# EAGLE design rwr_schematic (EAGLE 7.4.0)

## Sheet 1 of 8: Microcontroller Circuitry
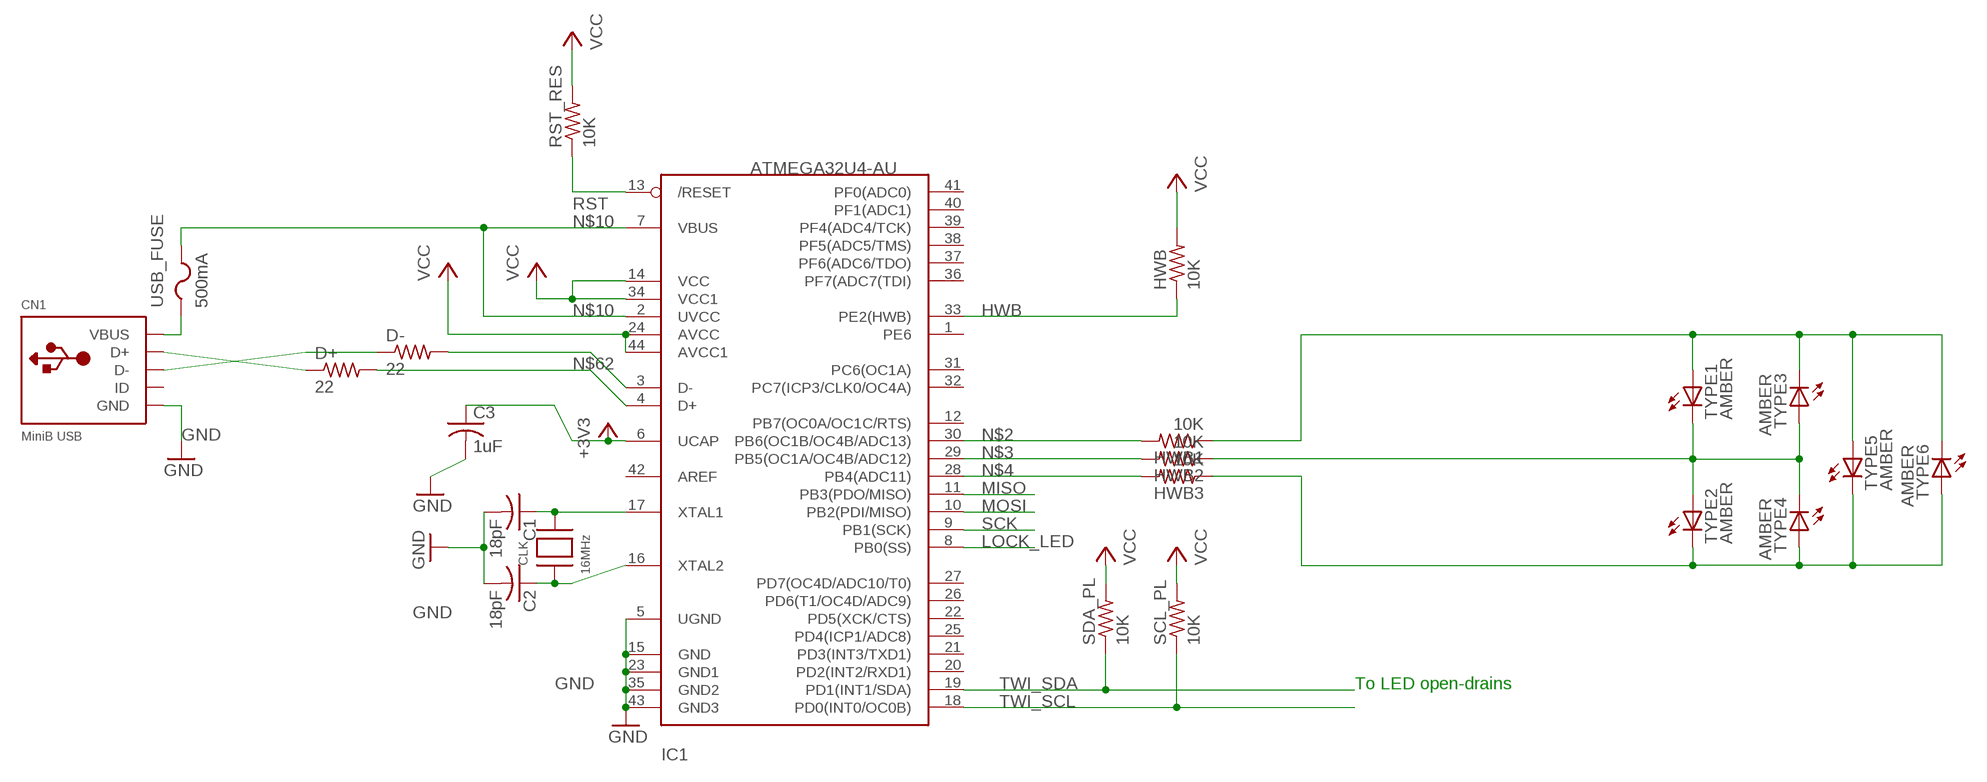
[diagram p0: schematic, sheet 1]

### Parts
C1  18pF  C-USC0805K  [C0805K]
C2  18pF  C-USC0805K  [C0805K]
C3  1uF  C-USC0805K  [C0805K]
CLK  16MHz  XTALNX5032  [NX5032]
CN1  MiniB USB  USBMINIB  [USB-MINIB]
D+  22  R-US_R0805  [R0805]
D-  22  R-US_R0805  [R0805]
HWB  10K  R-US_R0805  [R0805]
HWB1  10K  R-US_R0805  [R0805]
HWB2  10K  R-US_R0805  [R0805]
HWB3  10K  R-US_R0805  [R0805]
IC1  ATMEGA32U4-AU  [TQFP44]
RST_RES  10K  R-US_R0805  [R0805]
SCL_PL  10K  R-US_R0805  [R0805]
SDA_PL  10K  R-US_R0805  [R0805]
TYPE1  AMBER  LED3MM  [LED3MM]
TYPE2  AMBER  LED3MM  [LED3MM]
TYPE3  AMBER  LED3MM  [LED3MM]
TYPE4  AMBER  LED3MM  [LED3MM]
TYPE5  AMBER  LED3MM  [LED3MM]
TYPE6  AMBER  LED3MM  [LED3MM]
USB_FUSE  500mA  PTCFUSE-1206  [R1206]

### Nets
+3V3: C3.1 IC1.6(UCAP)
GND [Power]: C1.2 C2.2 C3.2 CN1.GND IC1.5(UGND) IC1.15(GND) IC1.23(GND1) IC1.35(GND2) IC1.43(GND3) ; also sheet 2,3,4,5,6,7,8
HWB: HWB.1 IC1.33(PE2(HWB))
LOCK_LED: IC1.8(PB0(SS)) ; also sheet 8
MISO: IC1.11(PB3(PDO/MISO)) ; also sheet 3
MOSI: IC1.10(PB2(PDI/MISO)) ; also sheet 3
N$2: HWB1.2 IC1.30(PB6(OC1B/OC4B/ADC13))
N$3: HWB2.2 IC1.29(PB5(OC1A/OC4B/ADC12))
N$4: HWB3.2 IC1.28(PB4(ADC11))
N$10: IC1.2(UVCC) IC1.7(VBUS) USB_FUSE.2
N$61: D-.2 IC1.3(D-)
N$62: D+.2 IC1.4(D+)
N$63: C2.1 CLK.P$1 IC1.16(XTAL2)
N$64: C1.1 CLK.P$2 IC1.17(XTAL1)
N$67: CN1.D+ D+.1
N$68: CN1.D- D-.1
RST: IC1.13(/RESET) RST_RES.1 ; also sheet 3
SCK: IC1.9(PB1(SCK)) ; also sheet 3
TWI_SCL: IC1.18(PD0(INT0/OC0B)) SCL_PL.1 ; also sheet 4,5,6,7
TWI_SDA: IC1.19(PD1(INT1/SDA)) SDA_PL.1 ; also sheet 4,5,6,7
TYPE_LED0: HWB3.1 TYPE2.K(C) TYPE4.A TYPE5.K(C) TYPE6.A
TYPE_LED1: HWB2.1 TYPE1.K(C) TYPE2.A TYPE3.A TYPE4.K(C)
TYPE_LED2: HWB1.1 TYPE1.A TYPE3.K(C) TYPE5.A TYPE6.K(C)
VBUS: CN1.VBUS USB_FUSE.1
VCC [Power]: HWB.2 IC1.14(VCC) IC1.24(AVCC) IC1.34(VCC1) IC1.44(AVCC1) RST_RES.2 SCL_PL.2 SDA_PL.2 ; also sheet 2,3,4,5,6,7,8
Unconnected: CN1.ID IC1.1(PE6) IC1.12(PB7(OC0A/OC1C/RTS)) IC1.20(PD2(INT2/RXD1)) IC1.21(PD3(INT3/TXD1)) IC1.22(PD5(XCK/CTS)) IC1.25(PD4(ICP1/ADC8)) IC1.26(PD6(T1/OC4D/ADC9)) IC1.27(PD7(OC4D/ADC10/T0)) IC1.31(PC6(OC1A)) IC1.32(PC7(ICP3/CLK0/OC4A)) IC1.36(PF7(ADC7(TDI)) IC1.37(PF6(ADC6/TDO)) IC1.38(PF5(ADC5/TMS)) IC1.39(PF4(ADC4/TCK)) IC1.40(PF1(ADC1)) IC1.41(PF0(ADC0)) IC1.42(AREF)

### Notes on the sheet
- To LED open-drains

## Sheet 2 of 8: Power Circuitry
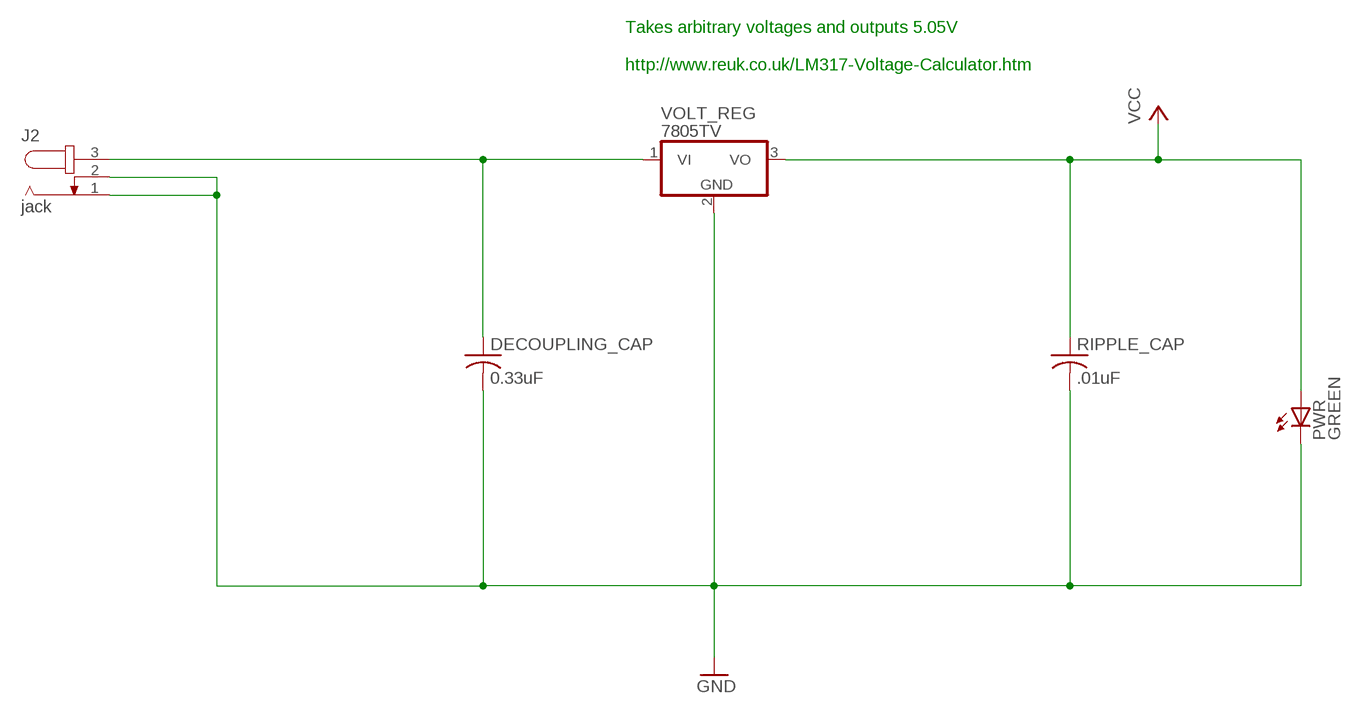
[diagram p1: schematic, sheet 2]

### Parts
DECOUPLING_CAP  0.33uF  C-USC0805K  [C0805K]
J2  jack  JACK-PLUG0  [SPC4077]
PWR  GREEN  LEDCHIPLED_0805  [CHIPLED_0805]
RIPPLE_CAP  .01uF  C-USC0805K  [C0805K]
VOLT_REG  7805TV  [TO220V]

### Nets
GND [Power]: DECOUPLING_CAP.2 J2.1 J2.2 PWR.C RIPPLE_CAP.2 VOLT_REG.2(GND) ; also sheet 1,3,4,5,6,7,8
JACK_VCC [Power]: DECOUPLING_CAP.1 J2.3 VOLT_REG.1(VI)
VCC [Power]: PWR.A RIPPLE_CAP.1 VOLT_REG.3(VO) ; also sheet 1,3,4,5,6,7,8

### Notes on the sheet
- Takes arbitrary voltages and outputs 5.05V
  
  http://www.reuk.co.uk/LM317-Voltage-Calculator.htm

## Sheet 3 of 8: ISP Programmer
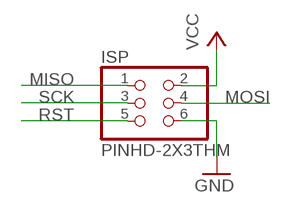
[diagram p2: schematic, sheet 3]

### Parts
ISP  PINHD-2X3THM  [ISP6]

### Nets
GND [Power]: ISP.6 ; also sheet 1,2,4,5,6,7,8
MISO: ISP.1 ; also sheet 1
MOSI: ISP.4 ; also sheet 1
RST: ISP.5 ; also sheet 1
SCK: ISP.3 ; also sheet 1
VCC [Power]: ISP.2 ; also sheet 1,2,4,5,6,7,8

## Sheet 4 of 8: Signal Strength LEDs
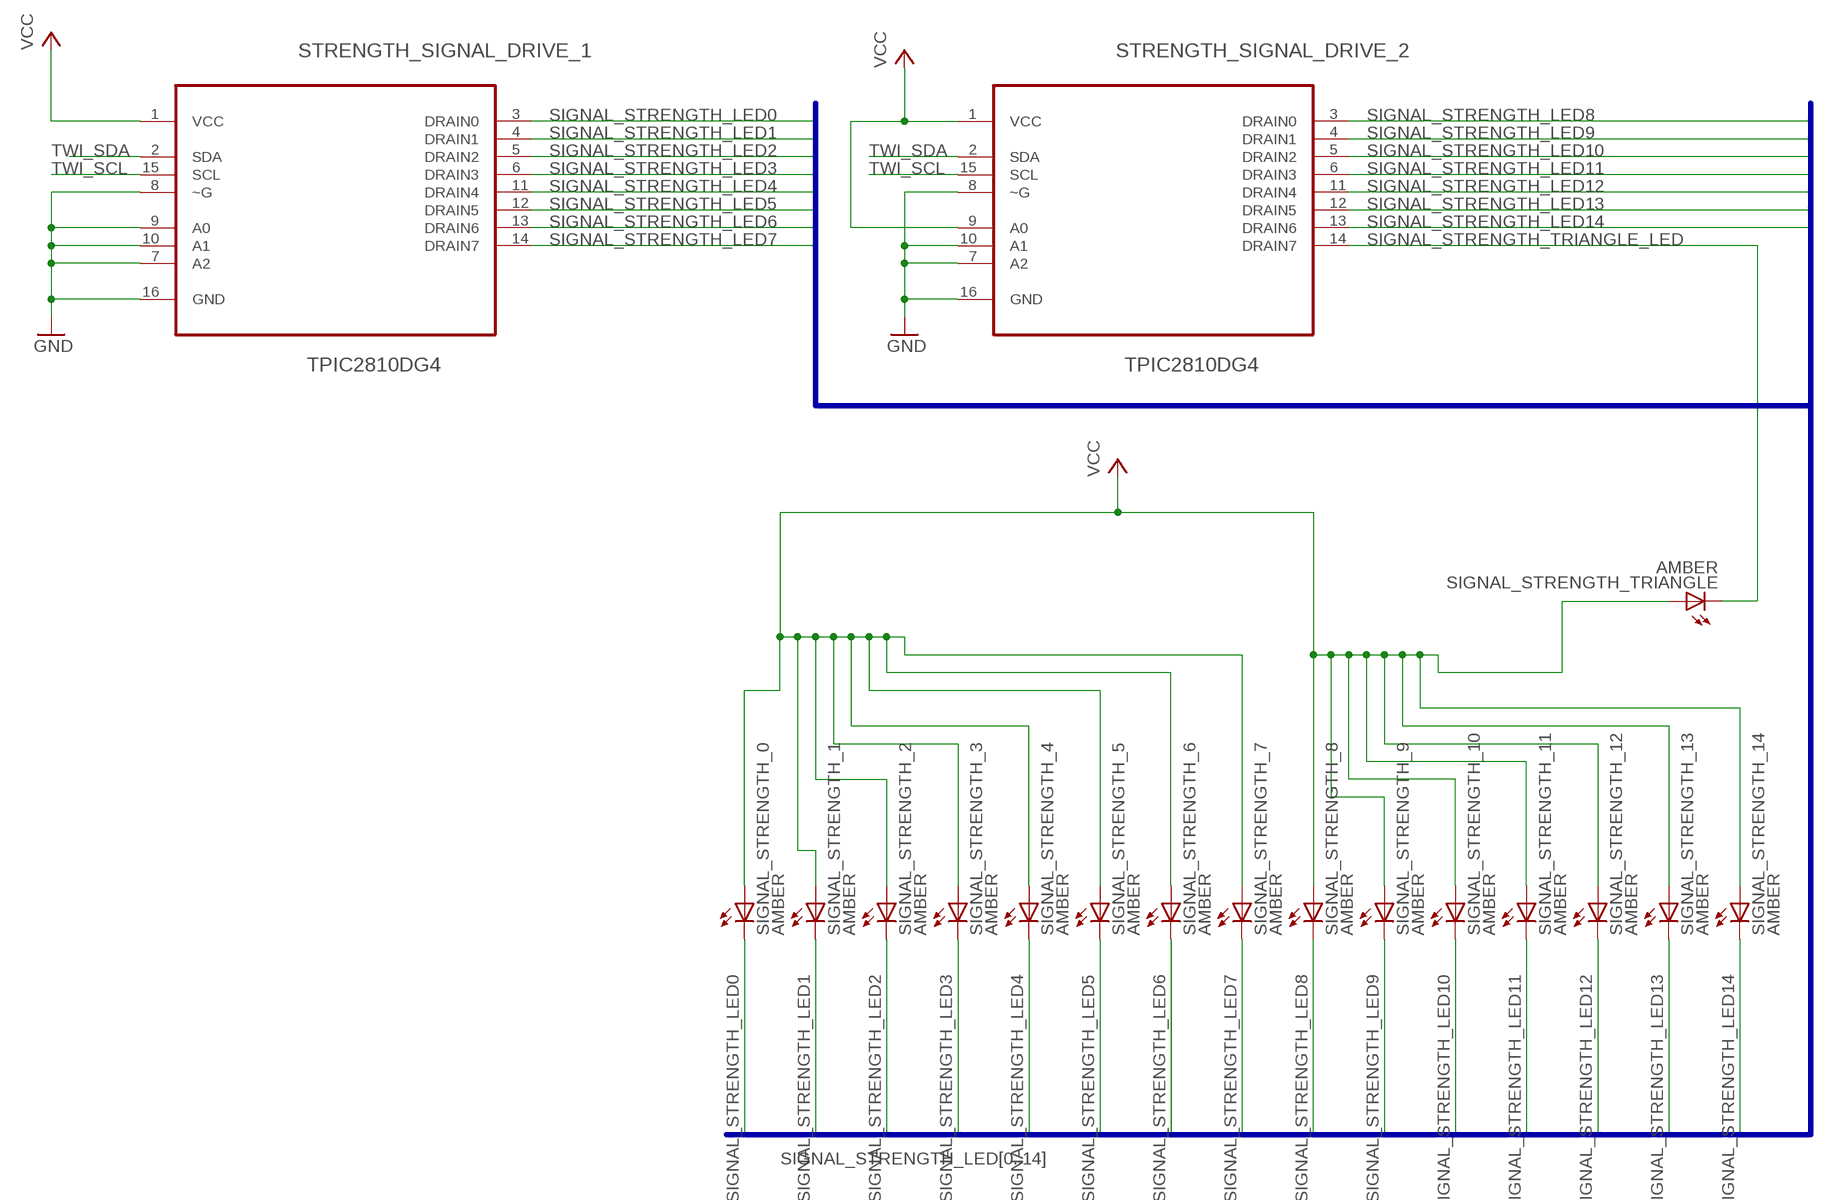
[diagram p3: schematic, sheet 4]

### Parts
SIGNAL_STRENGTH_0  AMBER  LED3MM  [LED3MM]
SIGNAL_STRENGTH_1  AMBER  LED3MM  [LED3MM]
SIGNAL_STRENGTH_2  AMBER  LED3MM  [LED3MM]
SIGNAL_STRENGTH_3  AMBER  LED3MM  [LED3MM]
SIGNAL_STRENGTH_4  AMBER  LED3MM  [LED3MM]
SIGNAL_STRENGTH_5  AMBER  LED3MM  [LED3MM]
SIGNAL_STRENGTH_6  AMBER  LED3MM  [LED3MM]
SIGNAL_STRENGTH_7  AMBER  LED3MM  [LED3MM]
SIGNAL_STRENGTH_8  AMBER  LED3MM  [LED3MM]
SIGNAL_STRENGTH_9  AMBER  LED3MM  [LED3MM]
SIGNAL_STRENGTH_10  AMBER  LED3MM  [LED3MM]
SIGNAL_STRENGTH_11  AMBER  LED3MM  [LED3MM]
SIGNAL_STRENGTH_12  AMBER  LED3MM  [LED3MM]
SIGNAL_STRENGTH_13  AMBER  LED3MM  [LED3MM]
SIGNAL_STRENGTH_14  AMBER  LED3MM  [LED3MM]
SIGNAL_STRENGTH_TRIANGLE  AMBER  LED3MM  [LED3MM]
STRENGTH_SIGNAL_DRIVE_1  TPIC2810DG4  [SOIC127P600X175-16N]
STRENGTH_SIGNAL_DRIVE_2  TPIC2810DG4  [SOIC127P600X175-16N]

### Nets
GND [Power]: STRENGTH_SIGNAL_DRIVE_1.7(A2) STRENGTH_SIGNAL_DRIVE_1.8(~G) STRENGTH_SIGNAL_DRIVE_1.9(A0) STRENGTH_SIGNAL_DRIVE_1.10(A1) STRENGTH_SIGNAL_DRIVE_1.16(GND) STRENGTH_SIGNAL_DRIVE_2.7(A2) STRENGTH_SIGNAL_DRIVE_2.8(~G) STRENGTH_SIGNAL_DRIVE_2.10(A1) STRENGTH_SIGNAL_DRIVE_2.16(GND) ; also sheet 1,2,3,5,6,7,8
SIGNAL_STRENGTH_LED0: SIGNAL_STRENGTH_0.K(C) STRENGTH_SIGNAL_DRIVE_1.3(DRAIN0)
SIGNAL_STRENGTH_LED1: SIGNAL_STRENGTH_1.K(C) STRENGTH_SIGNAL_DRIVE_1.4(DRAIN1)
SIGNAL_STRENGTH_LED2: SIGNAL_STRENGTH_2.K(C) STRENGTH_SIGNAL_DRIVE_1.5(DRAIN2)
SIGNAL_STRENGTH_LED3: SIGNAL_STRENGTH_3.K(C) STRENGTH_SIGNAL_DRIVE_1.6(DRAIN3)
SIGNAL_STRENGTH_LED4: SIGNAL_STRENGTH_4.K(C) STRENGTH_SIGNAL_DRIVE_1.11(DRAIN4)
SIGNAL_STRENGTH_LED5: SIGNAL_STRENGTH_5.K(C) STRENGTH_SIGNAL_DRIVE_1.12(DRAIN5)
SIGNAL_STRENGTH_LED6: SIGNAL_STRENGTH_6.K(C) STRENGTH_SIGNAL_DRIVE_1.13(DRAIN6)
SIGNAL_STRENGTH_LED7: SIGNAL_STRENGTH_7.K(C) STRENGTH_SIGNAL_DRIVE_1.14(DRAIN7)
SIGNAL_STRENGTH_LED8: SIGNAL_STRENGTH_8.K(C) STRENGTH_SIGNAL_DRIVE_2.3(DRAIN0)
SIGNAL_STRENGTH_LED9: SIGNAL_STRENGTH_9.K(C) STRENGTH_SIGNAL_DRIVE_2.4(DRAIN1)
SIGNAL_STRENGTH_LED10: SIGNAL_STRENGTH_10.K(C) STRENGTH_SIGNAL_DRIVE_2.5(DRAIN2)
SIGNAL_STRENGTH_LED11: SIGNAL_STRENGTH_11.K(C) STRENGTH_SIGNAL_DRIVE_2.6(DRAIN3)
SIGNAL_STRENGTH_LED12: SIGNAL_STRENGTH_12.K(C) STRENGTH_SIGNAL_DRIVE_2.11(DRAIN4)
SIGNAL_STRENGTH_LED13: SIGNAL_STRENGTH_13.K(C) STRENGTH_SIGNAL_DRIVE_2.12(DRAIN5)
SIGNAL_STRENGTH_LED14: SIGNAL_STRENGTH_14.K(C) STRENGTH_SIGNAL_DRIVE_2.13(DRAIN6)
SIGNAL_STRENGTH_TRIANGLE_LED: SIGNAL_STRENGTH_TRIANGLE.K(C) STRENGTH_SIGNAL_DRIVE_2.14(DRAIN7)
TWI_SCL: STRENGTH_SIGNAL_DRIVE_1.15(SCL) STRENGTH_SIGNAL_DRIVE_2.15(SCL) ; also sheet 1,5,6,7
TWI_SDA: STRENGTH_SIGNAL_DRIVE_1.2(SDA) STRENGTH_SIGNAL_DRIVE_2.2(SDA) ; also sheet 1,5,6,7
VCC [Power]: SIGNAL_STRENGTH_0.A SIGNAL_STRENGTH_1.A SIGNAL_STRENGTH_2.A SIGNAL_STRENGTH_3.A SIGNAL_STRENGTH_4.A SIGNAL_STRENGTH_5.A SIGNAL_STRENGTH_6.A SIGNAL_STRENGTH_7.A SIGNAL_STRENGTH_8.A SIGNAL_STRENGTH_9.A SIGNAL_STRENGTH_10.A SIGNAL_STRENGTH_11.A SIGNAL_STRENGTH_12.A SIGNAL_STRENGTH_13.A SIGNAL_STRENGTH_14.A SIGNAL_STRENGTH_TRIANGLE.A STRENGTH_SIGNAL_DRIVE_1.1(VCC) STRENGTH_SIGNAL_DRIVE_2.1(VCC) STRENGTH_SIGNAL_DRIVE_2.9(A0) ; also sheet 1,2,3,5,6,7,8

### Buses
SIGNAL_STRENGTH_LED[0..14]

## Sheet 5 of 8: Main target directional LEDs
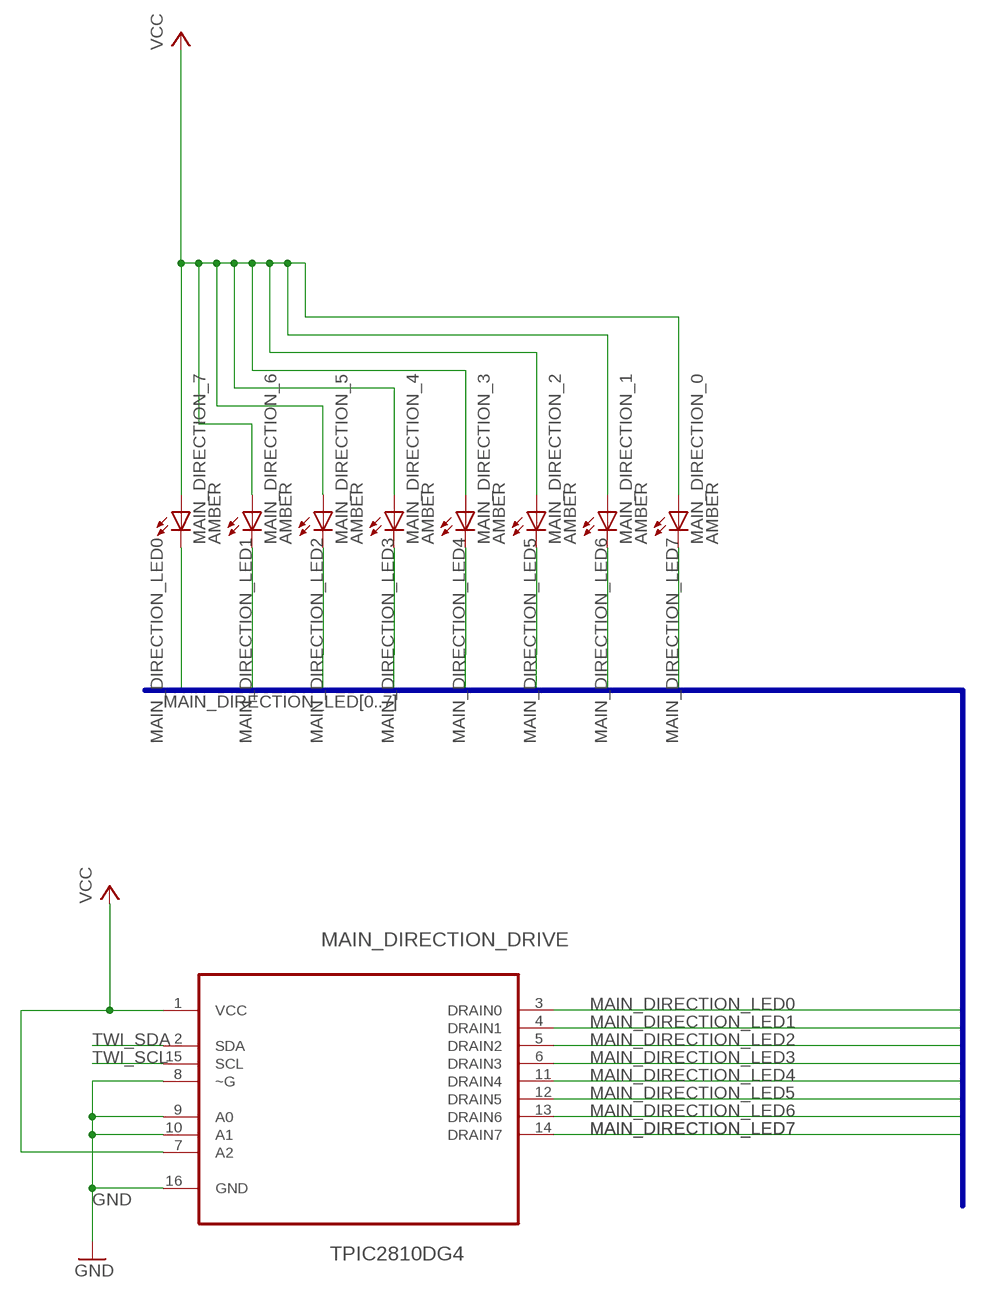
[diagram p4: schematic, sheet 5]

### Parts
MAIN_DIRECTION_0  AMBER  LED3MM  [LED3MM]
MAIN_DIRECTION_1  AMBER  LED3MM  [LED3MM]
MAIN_DIRECTION_2  AMBER  LED3MM  [LED3MM]
MAIN_DIRECTION_3  AMBER  LED3MM  [LED3MM]
MAIN_DIRECTION_4  AMBER  LED3MM  [LED3MM]
MAIN_DIRECTION_5  AMBER  LED3MM  [LED3MM]
MAIN_DIRECTION_6  AMBER  LED3MM  [LED3MM]
MAIN_DIRECTION_7  AMBER  LED3MM  [LED3MM]
MAIN_DIRECTION_DRIVE  TPIC2810DG4  [SOIC127P600X175-16N]

### Nets
GND [Power]: MAIN_DIRECTION_DRIVE.8(~G) MAIN_DIRECTION_DRIVE.9(A0) MAIN_DIRECTION_DRIVE.10(A1) MAIN_DIRECTION_DRIVE.16(GND) ; also sheet 1,2,3,4,6,7,8
MAIN_DIRECTION_LED0: MAIN_DIRECTION_7.K(C) MAIN_DIRECTION_DRIVE.3(DRAIN0)
MAIN_DIRECTION_LED1: MAIN_DIRECTION_6.K(C) MAIN_DIRECTION_DRIVE.4(DRAIN1)
MAIN_DIRECTION_LED2: MAIN_DIRECTION_5.K(C) MAIN_DIRECTION_DRIVE.5(DRAIN2)
MAIN_DIRECTION_LED3: MAIN_DIRECTION_4.K(C) MAIN_DIRECTION_DRIVE.6(DRAIN3)
MAIN_DIRECTION_LED4: MAIN_DIRECTION_3.K(C) MAIN_DIRECTION_DRIVE.11(DRAIN4)
MAIN_DIRECTION_LED5: MAIN_DIRECTION_2.K(C) MAIN_DIRECTION_DRIVE.12(DRAIN5)
MAIN_DIRECTION_LED6: MAIN_DIRECTION_1.K(C) MAIN_DIRECTION_DRIVE.13(DRAIN6)
MAIN_DIRECTION_LED7: MAIN_DIRECTION_0.K(C) MAIN_DIRECTION_DRIVE.14(DRAIN7)
TWI_SCL: MAIN_DIRECTION_DRIVE.15(SCL) ; also sheet 1,4,6,7
TWI_SDA: MAIN_DIRECTION_DRIVE.2(SDA) ; also sheet 1,4,6,7
VCC [Power]: MAIN_DIRECTION_0.A MAIN_DIRECTION_1.A MAIN_DIRECTION_2.A MAIN_DIRECTION_3.A MAIN_DIRECTION_4.A MAIN_DIRECTION_5.A MAIN_DIRECTION_6.A MAIN_DIRECTION_7.A MAIN_DIRECTION_DRIVE.1(VCC) MAIN_DIRECTION_DRIVE.7(A2) ; also sheet 1,2,3,4,6,7,8

### Buses
MAIN_DIRECTION_LED[0..7]

## Sheet 6 of 8: Other target directional LEDs
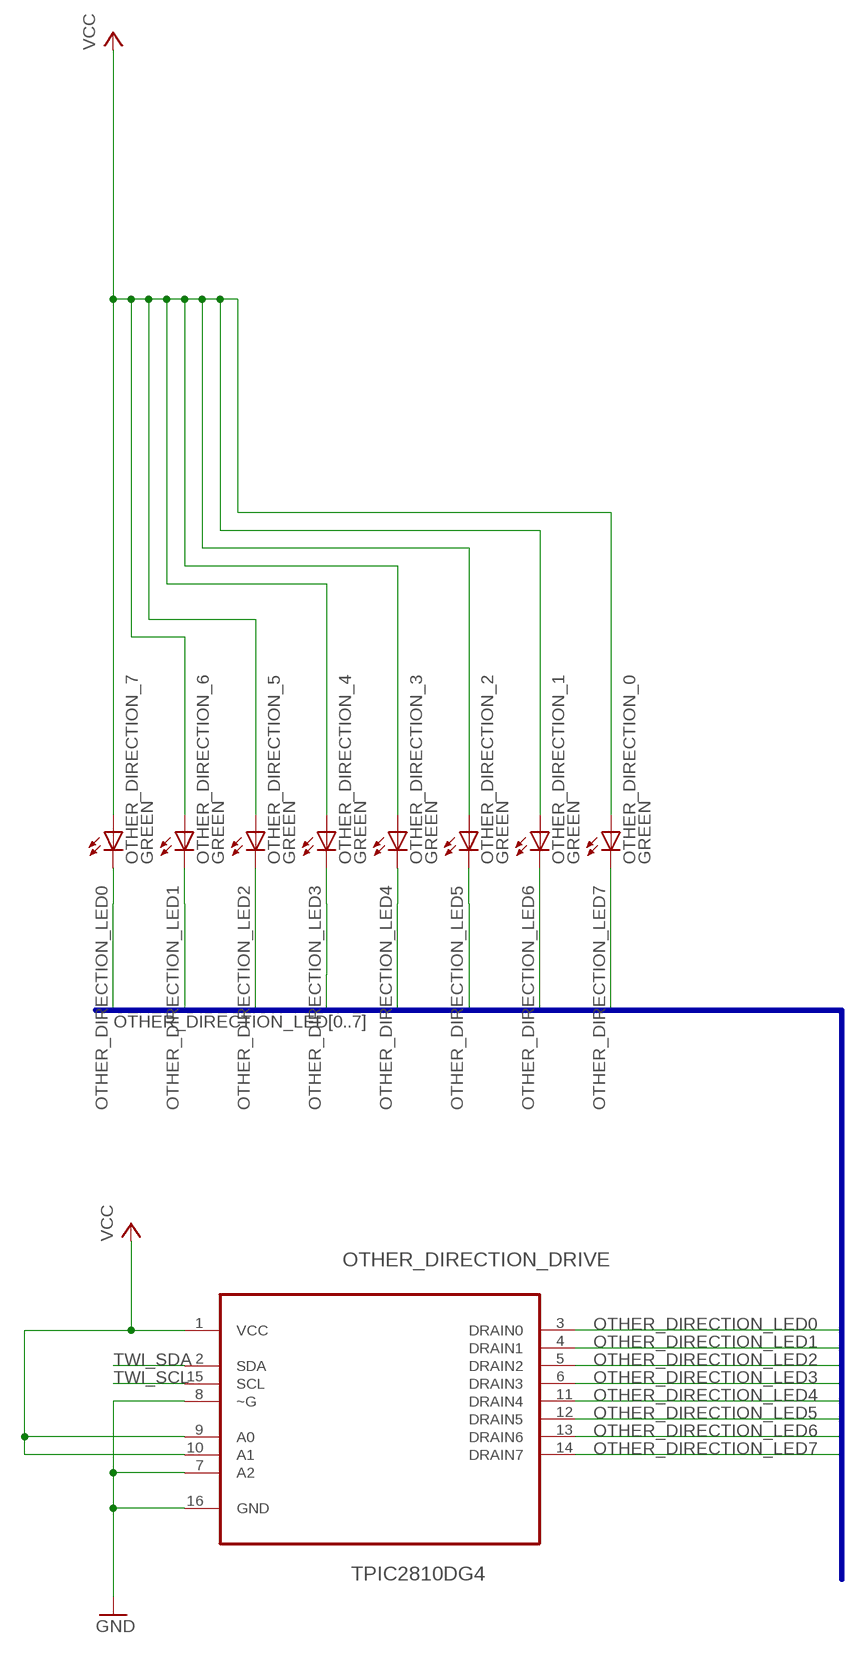
[diagram p5: schematic, sheet 6]

### Parts
OTHER_DIRECTION_0  GREEN  LED3MM  [LED3MM]
OTHER_DIRECTION_1  GREEN  LED3MM  [LED3MM]
OTHER_DIRECTION_2  GREEN  LED3MM  [LED3MM]
OTHER_DIRECTION_3  GREEN  LED3MM  [LED3MM]
OTHER_DIRECTION_4  GREEN  LED3MM  [LED3MM]
OTHER_DIRECTION_5  GREEN  LED3MM  [LED3MM]
OTHER_DIRECTION_6  GREEN  LED3MM  [LED3MM]
OTHER_DIRECTION_7  GREEN  LED3MM  [LED3MM]
OTHER_DIRECTION_DRIVE  TPIC2810DG4  [SOIC127P600X175-16N]

### Nets
GND [Power]: OTHER_DIRECTION_DRIVE.7(A2) OTHER_DIRECTION_DRIVE.8(~G) OTHER_DIRECTION_DRIVE.16(GND) ; also sheet 1,2,3,4,5,7,8
OTHER_DIRECTION_LED0: OTHER_DIRECTION_7.K(C) OTHER_DIRECTION_DRIVE.3(DRAIN0)
OTHER_DIRECTION_LED1: OTHER_DIRECTION_6.K(C) OTHER_DIRECTION_DRIVE.4(DRAIN1)
OTHER_DIRECTION_LED2: OTHER_DIRECTION_5.K(C) OTHER_DIRECTION_DRIVE.5(DRAIN2)
OTHER_DIRECTION_LED3: OTHER_DIRECTION_4.K(C) OTHER_DIRECTION_DRIVE.6(DRAIN3)
OTHER_DIRECTION_LED4: OTHER_DIRECTION_3.K(C) OTHER_DIRECTION_DRIVE.11(DRAIN4)
OTHER_DIRECTION_LED5: OTHER_DIRECTION_2.K(C) OTHER_DIRECTION_DRIVE.12(DRAIN5)
OTHER_DIRECTION_LED6: OTHER_DIRECTION_1.K(C) OTHER_DIRECTION_DRIVE.13(DRAIN6)
OTHER_DIRECTION_LED7: OTHER_DIRECTION_0.K(C) OTHER_DIRECTION_DRIVE.14(DRAIN7)
TWI_SCL: OTHER_DIRECTION_DRIVE.15(SCL) ; also sheet 1,4,5,7
TWI_SDA: OTHER_DIRECTION_DRIVE.2(SDA) ; also sheet 1,4,5,7
VCC [Power]: OTHER_DIRECTION_0.A OTHER_DIRECTION_1.A OTHER_DIRECTION_2.A OTHER_DIRECTION_3.A OTHER_DIRECTION_4.A OTHER_DIRECTION_5.A OTHER_DIRECTION_6.A OTHER_DIRECTION_7.A OTHER_DIRECTION_DRIVE.1(VCC) OTHER_DIRECTION_DRIVE.9(A0) OTHER_DIRECTION_DRIVE.10(A1) ; also sheet 1,2,3,4,5,7,8

### Buses
OTHER_DIRECTION_LED[0..7]

## Sheet 7 of 8: Misc LEDs
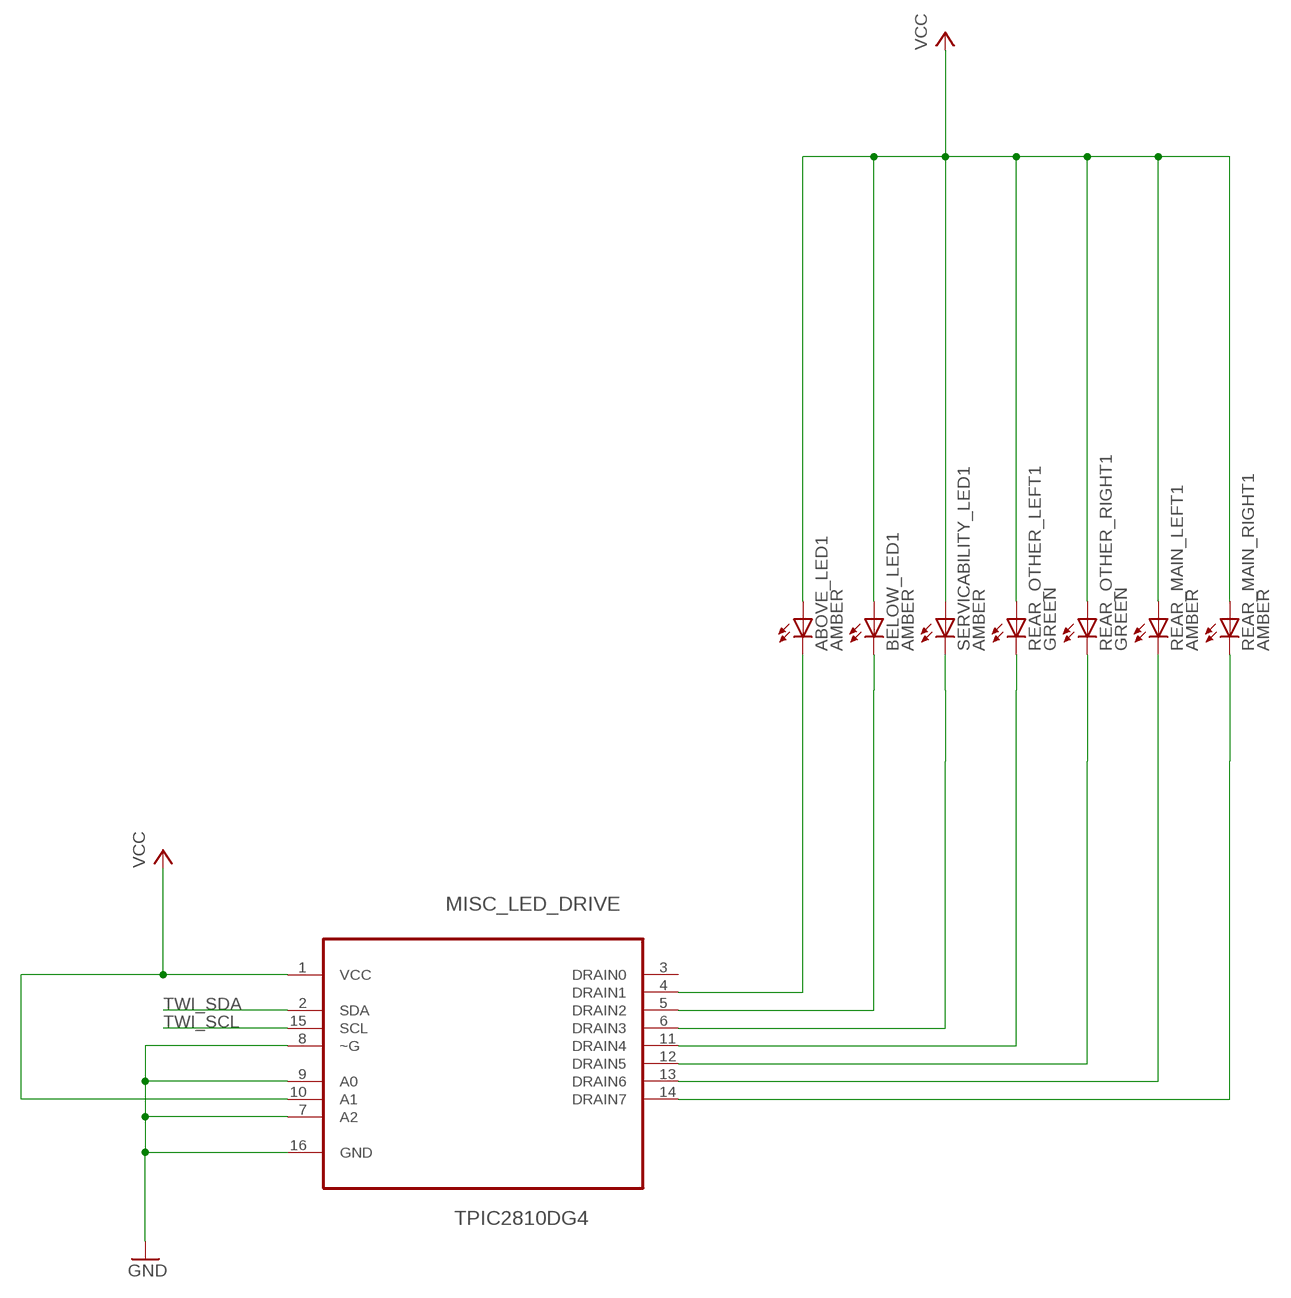
[diagram p6: schematic, sheet 7]

### Parts
ABOVE_LED1  AMBER  LED3MM  [LED3MM]
BELOW_LED1  AMBER  LED3MM  [LED3MM]
MISC_LED_DRIVE  TPIC2810DG4  [SOIC127P600X175-16N]
REAR_MAIN_LEFT1  AMBER  LED3MM  [LED3MM]
REAR_MAIN_RIGHT1  AMBER  LED3MM  [LED3MM]
REAR_OTHER_LEFT1  GREEN  LED3MM  [LED3MM]
REAR_OTHER_RIGHT1  GREEN  LED3MM  [LED3MM]
SERVICABILITY_LED1  AMBER  LED3MM  [LED3MM]

### Nets
GND [Power]: MISC_LED_DRIVE.7(A2) MISC_LED_DRIVE.8(~G) MISC_LED_DRIVE.9(A0) MISC_LED_DRIVE.16(GND) ; also sheet 1,2,3,4,5,6,8
N$15: MISC_LED_DRIVE.12(DRAIN5) REAR_OTHER_RIGHT1.K(C)
N$16: MISC_LED_DRIVE.14(DRAIN7) REAR_MAIN_RIGHT1.K(C)
N$17: ABOVE_LED1.K(C) MISC_LED_DRIVE.4(DRAIN1)
N$19: MISC_LED_DRIVE.6(DRAIN3) SERVICABILITY_LED1.K(C)
N$21: MISC_LED_DRIVE.11(DRAIN4) REAR_OTHER_LEFT1.K(C)
N$25: BELOW_LED1.K(C) MISC_LED_DRIVE.5(DRAIN2)
REAR_MAIN_LEFT1: MISC_LED_DRIVE.13(DRAIN6) REAR_MAIN_LEFT1.K(C)
TWI_SCL: MISC_LED_DRIVE.15(SCL) ; also sheet 1,4,5,6
TWI_SDA: MISC_LED_DRIVE.2(SDA) ; also sheet 1,4,5,6
VCC [Power]: ABOVE_LED1.A BELOW_LED1.A MISC_LED_DRIVE.1(VCC) MISC_LED_DRIVE.10(A1) REAR_MAIN_LEFT1.A REAR_MAIN_RIGHT1.A REAR_OTHER_LEFT1.A REAR_OTHER_RIGHT1.A SERVICABILITY_LED1.A ; also sheet 1,2,3,4,5,6,8
Unconnected: MISC_LED_DRIVE.3(DRAIN0)

## Sheet 8 of 8: Lock LEDs
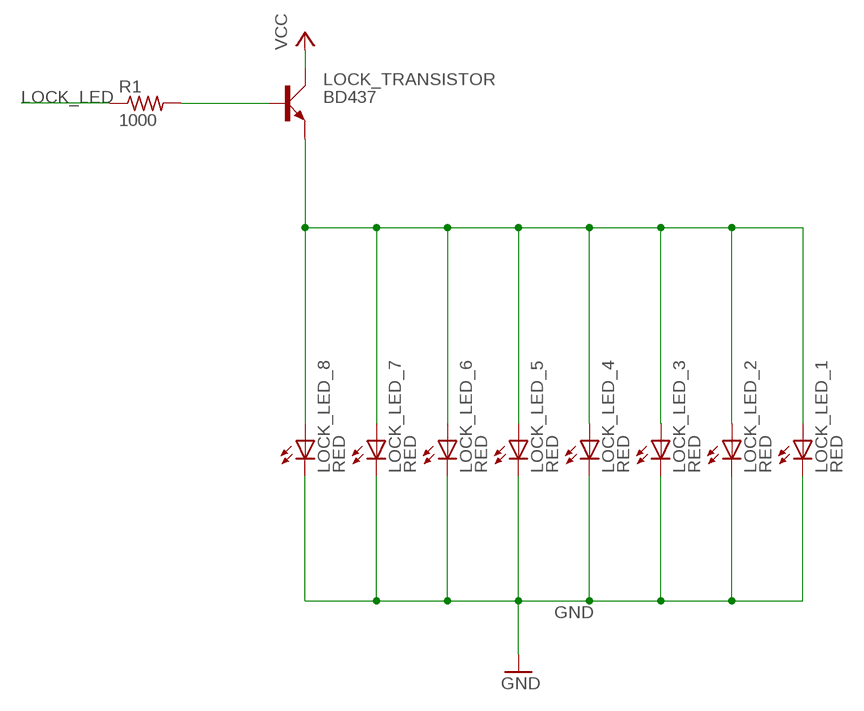
[diagram p7: schematic, sheet 8]

### Parts
LOCK_LED_1  RED  LED3MM  [LED3MM]
LOCK_LED_2  RED  LED3MM  [LED3MM]
LOCK_LED_3  RED  LED3MM  [LED3MM]
LOCK_LED_4  RED  LED3MM  [LED3MM]
LOCK_LED_5  RED  LED3MM  [LED3MM]
LOCK_LED_6  RED  LED3MM  [LED3MM]
LOCK_LED_7  RED  LED3MM  [LED3MM]
LOCK_LED_8  RED  LED3MM  [LED3MM]
LOCK_TRANSISTOR  BD437  [TO126AV]
R1  1000  R-US_R0805  [R0805]

### Nets
GND [Power]: LOCK_LED_1.K(C) LOCK_LED_2.K(C) LOCK_LED_3.K(C) LOCK_LED_4.K(C) LOCK_LED_5.K(C) LOCK_LED_6.K(C) LOCK_LED_7.K(C) LOCK_LED_8.K(C) ; also sheet 1,2,3,4,5,6,7
LOCK_LED: R1.1 ; also sheet 1
LOCK_LED_1 [Power]: LOCK_LED_1.A LOCK_LED_2.A LOCK_LED_3.A LOCK_LED_4.A LOCK_LED_5.A LOCK_LED_6.A LOCK_LED_7.A LOCK_LED_8.A LOCK_TRANSISTOR.E
N$1: LOCK_TRANSISTOR.B R1.2
VCC [Power]: LOCK_TRANSISTOR.C ; also sheet 1,2,3,4,5,6,7

## Library data of the parts
ABOVE_LED1 BELOW_LED1 LOCK_LED_1-LOCK_LED_8 MAIN_DIRECTION_0 MAIN_DIRECTION_1-MAIN_DIRECTION_7 OTHER_DIRECTION_0 OTHER_DIRECTION_1-OTHER_DIRECTION_7 REAR_MAIN_LEFT1 REAR_MAIN_RIGHT1 REAR_OTHER_LEFT1 REAR_OTHER_RIGHT1 SERVICABILITY_LED1 SIGNAL_STRENGTH_0 SIGNAL_STRENGTH_1-SIGNAL_STRENGTH_14 SIGNAL_STRENGTH_TRIANGLE TYPE1-TYPE6 = led:LED: LED; OC_NEWARK: unknown
C1-C3 DECOUPLING_CAP RIPPLE_CAP = adafruit:C-US: CAPACITOR, American symbol
CLK = adaprog:XTAL
CN1 = adafruit:USB: USB Connectors USBMINIB - Surface Mount Female Mini-B USB Connector 4UConnector: 06564 By microbuilder.eu Thru-hole RA Female Mini-B USB Connector 4UConnector: 18732 By ladyada.net
D+ D- HWB HWB1-HWB3 RST_RES SCL_PL SDA_PL = adafruit:R-US_: RESISTOR, American symbol
IC1 = adaprog:ATMEGA32U4
ISP = adaprog:PINHD-2X3
J2 = con-jack:JACK-PLUG: DC POWER JACK Power Jack, DC, Right Angle, Through Hole, Rated 5A at 16VDC, PC Terminals Distributor: Farnell (www.Farnell.de) Drawing: 84N1161.pdf / 84N1162.pdf Manufacturer: SPC Technology (www.spctechnology.com) Type: SPC4077 / SPC 4078; OC_FARNELL: unknown; OC_NEWARK: unknown
LOCK_TRANSISTOR = transistor-power:BD437: NPN TRANSISTOR
MAIN_DIRECTION_DRIVE MISC_LED_DRIVE OTHER_DIRECTION_DRIVE STRENGTH_SIGNAL_DRIVE_1 STRENGTH_SIGNAL_DRIVE_2 = ti_led_driver:TPIC2810DG4: 8-BIT LED DRIVER WITH I2C INTERFACE; MPN: TPIC2810DG4; OC_FARNELL: -; OC_NEWARK: 02M4281; PACKAGE: SOIC-16; SUPPLIER: TEXAS INSTRUMENTS
PWR = adafruit:LED: LED
R1 = resistor:R-US_: RESISTOR, American symbol
USB_FUSE = adafruit:PTCFUSE: PTC fuses, resettable thermistors
VOLT_REG = linear:78*: Positive VOLTAGE REGULATOR Source: http://cache.national.com/ds/LM/LM78L05.pdf http://www.fairchildsemi.com/ds/LM/LM7805.pdf

## Net classes
0 default: width 0.254 mm
1 Power: width 0.406 mm

## Board
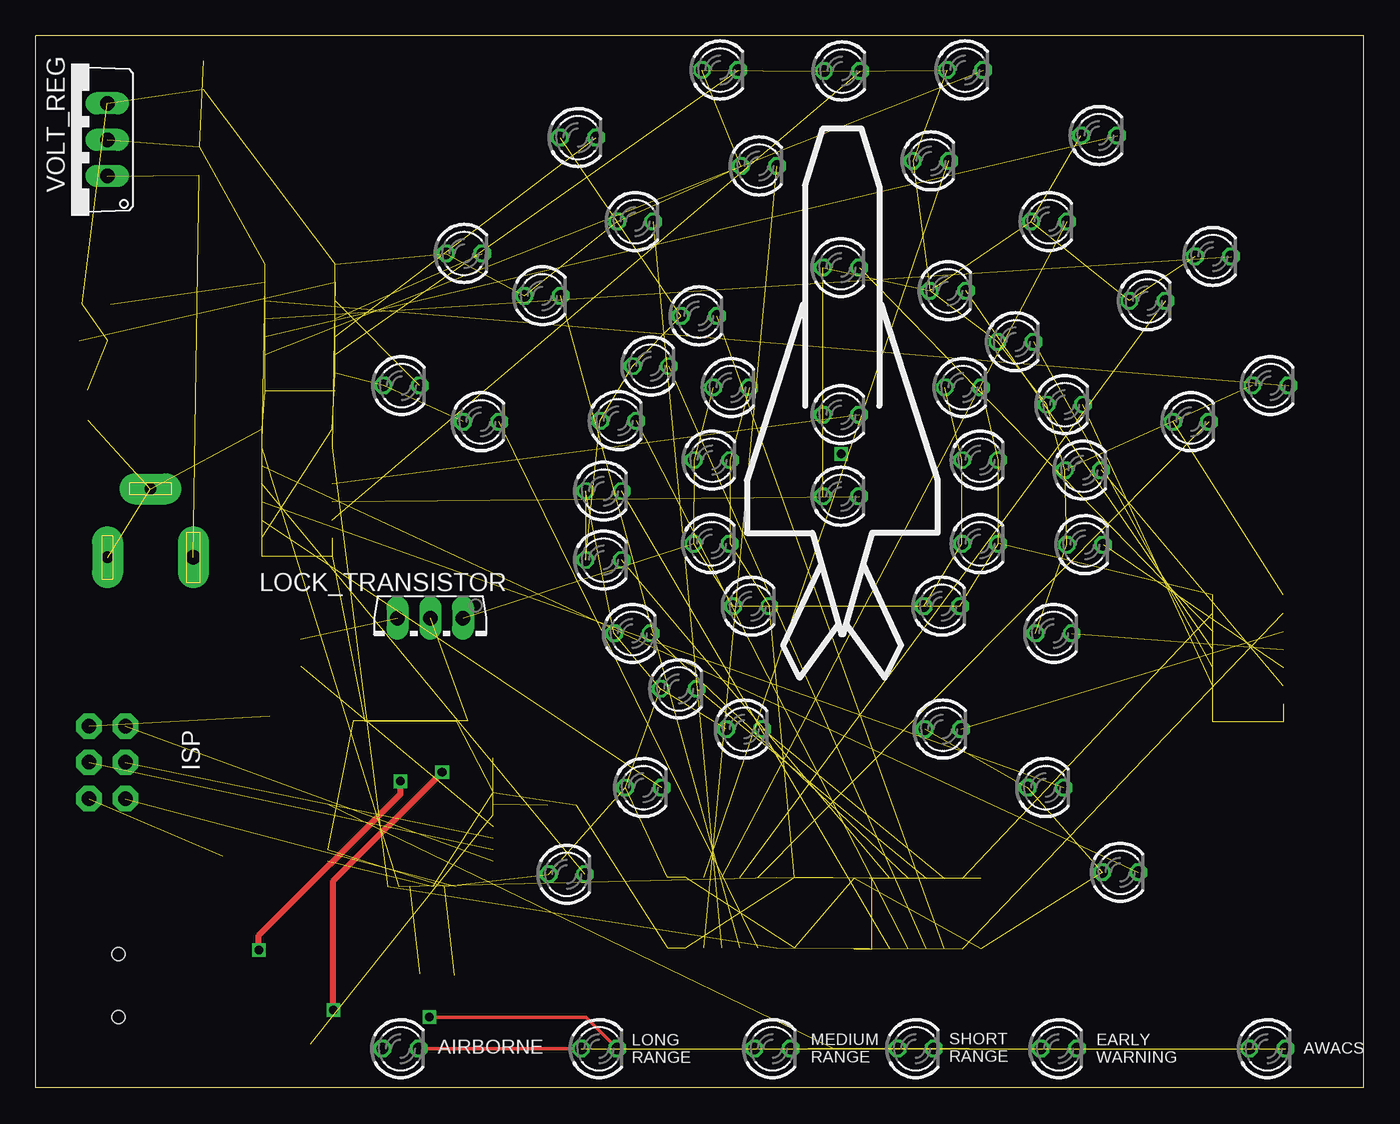
[diagram p8: board, top side]
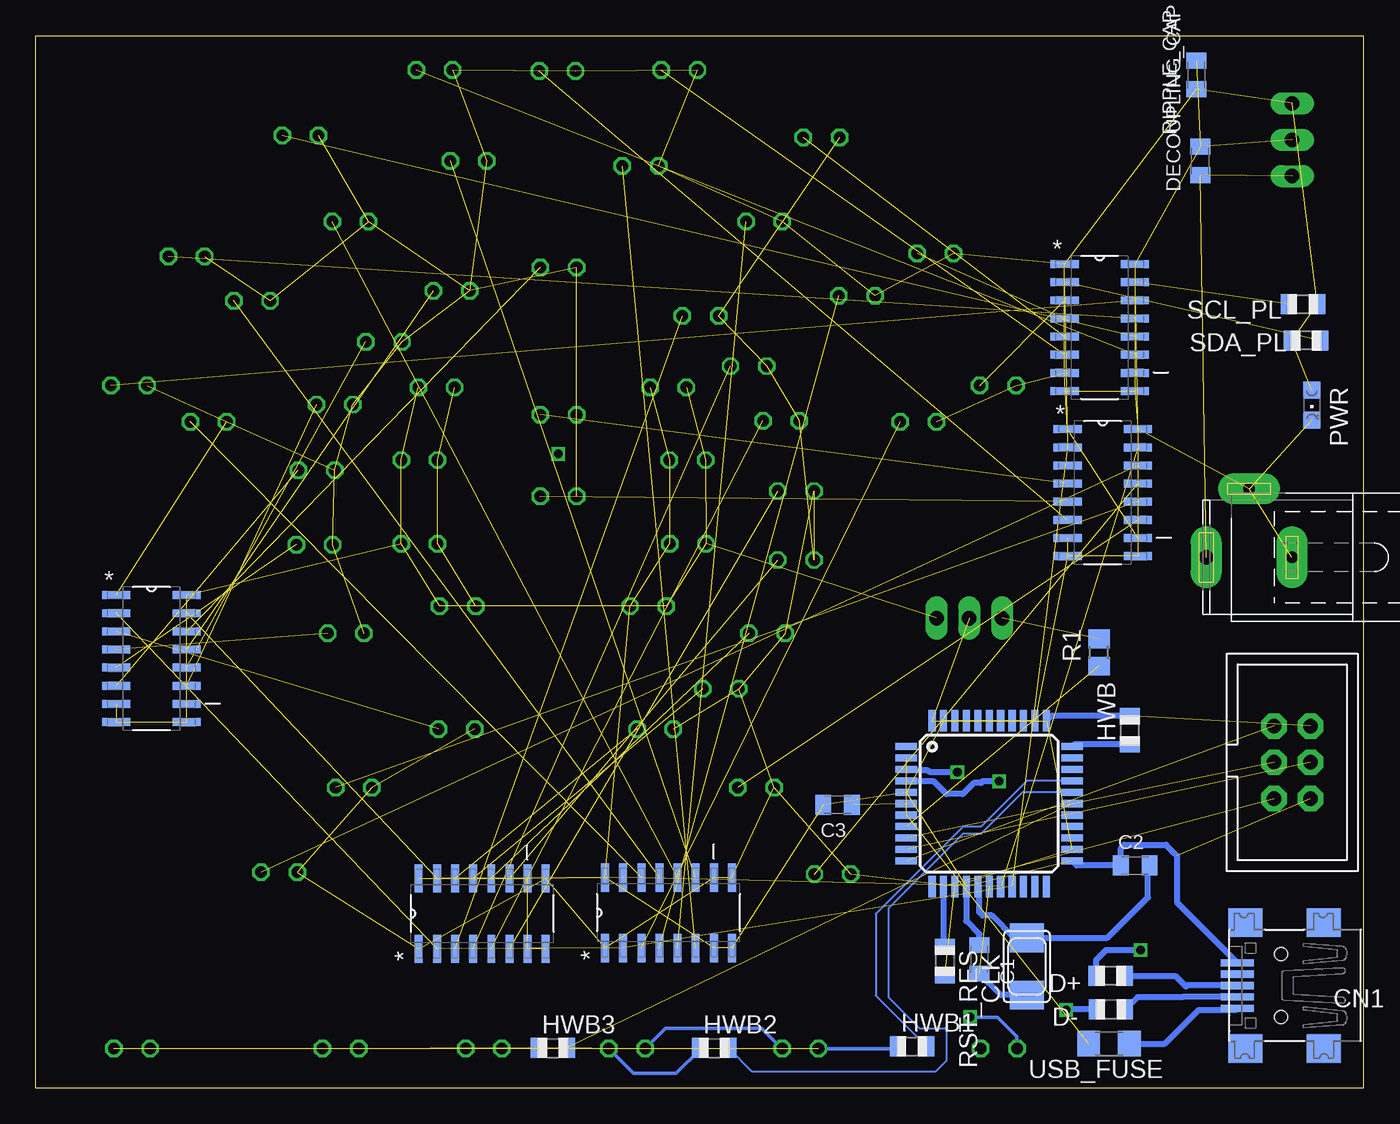
[diagram p9: board, bottom side, seen from below]

Size 92.96 x 73.66 mm. Coordinates in mm from the lower left corner, seen from the top.
Outline: 92.96,0 92.96,73.66 0,73.66 0,0 92.96,0
Copper layers (1*16): Top 0.0356mm / dielectric 1.5011mm / Bottom 0.0356mm
Design rules "LaenPCBOrder": minimum track width 6mil, minimum drill 13mil, track to track 6mil, track to pad 6mil, pad to pad 6mil, via to via 6mil, smd to smd 6mil, copper to edge 15mil, drill to drill 6mil, minimum pad ring 7mil, minimum via ring 7mil, stop-mask expansion 3mil, vias tented up to drill 0mil, thermal gap 10mil

### Footprints (pad centres in the part's own frame; a part is rotated, then mirrored left to right if it is on the bottom)
LED3MM = drill 0.813 octagon: A -1.27,0; K 1.27,0
C0805K = smd 1.1 x 1.4: 1 -1,0; 2 1,0
NX5032 = smd 2 x 2.4: P$1 2,0; P$2 -2,0
USB-MINIB = smd 0.5 x 2.308: D+ 0,4.064; D- -0.8,4.064; GND 1.6,4.064; ID 0.8,4.064; VBUS -1.6,4.064 | smd 2 x 2.4: GND1 -4.4,-2; GND2 -4.4,3.5; GND3 4.4,3.5; GND4 4.4,-2 | hole 0.9: -2.2,1; 2.2,1
R0805 = smd 1.1 x 1.4: 1 -1,0; 2 1,0
TQFP44 = smd 1.5 x 0.5: 1 -5.8,4; 2 -5.8,3.2; 3 -5.8,2.4; 4 -5.8,1.6; 5 -5.8,0.8; 6 -5.8,0; 7 -5.8,-0.8; 8 -5.8,-1.6; 9 -5.8,-2.4; 10 -5.8,-3.2; 11 -5.8,-4; 23 5.8,-4; 24 5.8,-3.2; 25 5.8,-2.4; 26 5.8,-1.6; 27 5.8,-0.8; 28 5.8,0; 29 5.8,0.8; 30 5.8,1.6; 31 5.8,2.4; 32 5.8,3.2; 33 5.8,4 | smd 0.5 x 1.5: 12 -4,-5.8; 13 -3.2,-5.8; 14 -2.4,-5.8; 15 -1.6,-5.8; 16 -0.8,-5.8; 17 0,-5.8; 18 0.8,-5.8; 19 1.6,-5.8; 20 2.4,-5.8; 21 3.2,-5.8; 22 4,-5.8; 34 4,5.8; 35 3.2,5.8; 36 2.4,5.8; 37 1.6,5.8; 38 0.8,5.8; 39 0,5.8; 40 -0.8,5.8; 41 -1.6,5.8; 42 -2.4,5.8; 43 -3.2,5.8; 44 -4,5.8
ISP6 = drill 1.016 pad 1.778 octagon: 1 -2.54,-1.27; 2 -2.54,1.27; 3 0,-1.27; 4 0,1.27; 5 2.54,-1.27; 6 2.54,1.27
SPC4077 = drill 0.8 pad 2.184 long: 1 -3,0; 2 0,-4.8 | drill 1 pad 2.184 long: 3 3,0
TO126AV = drill 1.016 long: B 2.286,-1.27; C 0,-1.27; E -2.286,-1.27
SOIC127P600X175-16N = smd 1.981 x 0.559: 1 -2.464,4.445; 2 -2.464,3.175; 3 -2.464,1.905; 4 -2.464,0.635; 5 -2.464,-0.635; 6 -2.464,-1.905; 7 -2.464,-3.175; 8 -2.464,-4.445; 9 2.464,-4.445; 10 2.464,-3.175; 11 2.464,-1.905; 12 2.464,-0.635; 13 2.464,0.635; 14 2.464,1.905; 15 2.464,3.175; 16 2.464,4.445
CHIPLED_0805 = smd 1.2 x 1.2: A 0,-1.05; C 0,1.05
R0805' = smd 1.3 x 1.5: 1 -0.95,0; 2 0.95,0
R1206 = smd 1.6 x 1.803: 1 -1.422,0; 2 1.422,0
TO220V = drill 1.016 long: 1 -2.54,-2.54; 2 0,-2.54; 3 2.54,-2.54

### Placement (x,y rotation side)
ABOVE_LED1  56.37,47.13 0 top
BELOW_LED1  56.37,41.42 0 top
C1  26.9,9 90 bottom
C2  16,15.57 180 bottom
C3  36.83,19.83 180 bottom
CLK  23.58,8.51 90 bottom
CN1  4.8,7.17 90 bottom
D+  17.72,7.85 180 bottom
D-  17.71,5.49 180 bottom
DECOUPLING_CAP  11.46,64.9 90 bottom
HWB  16.37,25.03 90 bottom
HWB1  31.62,2.92 0 bottom
HWB2  45.47,2.79 0 bottom
HWB3  56.77,2.79 0 bottom
IC1  26.22,19.9 0 bottom
ISP  5.01,22.79 270 bottom
J2  8.03,37.14 180 bottom
LOCK_LED_1  48.68,49.04 0 top
LOCK_LED_2  47.34,43.96 0 top
LOCK_LED_3  47.31,38.1 0 top
LOCK_LED_4  50.09,33.73 0 top
LOCK_LED_5  63.43,33.73 0 top
LOCK_LED_6  66.11,38.1 0 top
LOCK_LED_7  66.11,43.96 0 top
LOCK_LED_8  64.91,49.04 0 top
LOCK_TRANSISTOR  27.62,31.62 180 top
MAIN_DIRECTION_0  86.43,49.18 0 top
MAIN_DIRECTION_1  82.41,58.21 0 top
MAIN_DIRECTION_2  74.44,66.67 0 top
MAIN_DIRECTION_3  65.05,71.26 0 top
MAIN_DIRECTION_4  47.91,71.26 0 top
MAIN_DIRECTION_5  37.96,66.53 0 top
MAIN_DIRECTION_6  29.99,58.42 0 top
MAIN_DIRECTION_7  25.61,49.18 0 top
MAIN_DIRECTION_DRIVE  18.48,53.23 0 bottom
MISC_LED_DRIVE  18.27,41.67 0 bottom
OTHER_DIRECTION_0  80.87,46.64 0 top
OTHER_DIRECTION_1  77.82,55.1 0 top
OTHER_DIRECTION_2  70.94,60.65 0 top
OTHER_DIRECTION_3  62.67,64.9 0 top
OTHER_DIRECTION_4  50.63,64.54 0 top
OTHER_DIRECTION_5  41.97,60.65 0 top
OTHER_DIRECTION_6  35.47,55.46 0 top
OTHER_DIRECTION_7  31.17,46.64 0 top
OTHER_DIRECTION_DRIVE  48.67,12.26 90 bottom
PWR  3.64,47.81 180 bottom
R1  1000  [R0805']  18.54,30.48 90 bottom
REAR_MAIN_LEFT1  37.18,14.96 0 top
REAR_MAIN_RIGHT1  75.92,15.1 0 top
REAR_OTHER_LEFT1  42.54,21.03 0 top
REAR_OTHER_RIGHT1  70.7,21.03 0 top
RIPPLE_CAP  11.73,70.91 90 bottom
RST_RES  29.34,8.89 270 bottom
SCL_PL  4.26,54.86 0 bottom
SDA_PL  4.05,52.32 180 bottom
SERVICABILITY_LED1  56.45,71.19 0 top
SIGNAL_STRENGTH_0  63.5,25.12 0 top
SIGNAL_STRENGTH_1  71.26,31.82 0 top
SIGNAL_STRENGTH_2  73.45,38.03 0 top
SIGNAL_STRENGTH_3  73.31,43.25 0 top
SIGNAL_STRENGTH_4  72.04,47.84 0 top
SIGNAL_STRENGTH_5  68.59,52.23 0 top
SIGNAL_STRENGTH_6  63.85,55.81 0 top
SIGNAL_STRENGTH_7  56.37,57.43 0 top
SIGNAL_STRENGTH_8  46.43,54.05 0 top
SIGNAL_STRENGTH_9  43.06,50.53 0 top
SIGNAL_STRENGTH_10  40.78,46.71 0 top
SIGNAL_STRENGTH_11  39.75,41.78 0 top
SIGNAL_STRENGTH_12  39.75,36.96 0 top
SIGNAL_STRENGTH_13  41.77,31.82 0 top
SIGNAL_STRENGTH_14  45.01,27.94 0 top
SIGNAL_STRENGTH_TRIANGLE  49.6,25.12 0 top
STRENGTH_SIGNAL_DRIVE_1  84.86,30.06 0 bottom
STRENGTH_SIGNAL_DRIVE_2  61.71,12.21 90 bottom
TYPE1  86.22,2.75 0 top
TYPE2  71.61,2.75 0 top
TYPE3  61.6,2.75 0 top
TYPE4  51.58,2.75 0 top
TYPE5  39.44,2.75 0 top
TYPE6  25.54,2.75 0 top
USB_FUSE  17.84,3.1 180 bottom
VOLT_REG  2.47,66.38 90 top

### Tracks (layer width: path | path; a pad name or v marks a point on that pad's centre or on a via)
+3V3  (1 unrouted)
GND  (40 unrouted)
  Bottom 0.406: C1.2 26.9,10.77 27.82,11.69 IC1.15 | IC1.23 20.09,15.56 C2.2 17,16.78 16.76,17.02 13.84,17.02 13.08,16.26 13.08,12.99 CN1.GND
HWB
  Bottom 0.406: HWB.1 20.28,24.03 IC1.33
JACK_VCC  (2 unrouted)
LOCK_LED  (1 unrouted)
LOCK_LED_1  (8 unrouted)
MAIN_DIRECTION_LED0  (1 unrouted)
MAIN_DIRECTION_LED1  (1 unrouted)
MAIN_DIRECTION_LED2  (1 unrouted)
MAIN_DIRECTION_LED3  (1 unrouted)
MAIN_DIRECTION_LED4  (1 unrouted)
MAIN_DIRECTION_LED5  (1 unrouted)
MAIN_DIRECTION_LED6  (1 unrouted)
MAIN_DIRECTION_LED7  (1 unrouted)
MISO  (1 unrouted)
MOSI  (1 unrouted)
N$1  (1 unrouted)
N$2
  Bottom 0.152: IC1.30 23.59,21.5 26.8,18.29 28.07,18.29 34.16,12.19 34.16,6.46 HWB1.2
N$3
  Bottom 0.152: IC1.29 23.88,20.7 26.8,17.78 28.07,17.78 33.27,12.57 33.27,6.35 31.11,4.19 29.34,4.19 29.21,4.06 29.21,1.91 29.97,1.14 42.81,1.14 HWB2.2
N$4  (1 unrouted)
N$10  (2 unrouted)
N$15  (1 unrouted)
N$16  (1 unrouted)
N$17  (1 unrouted)
N$18  (via drill 0.6)
  other vias: 56.37,44.38
N$19  (1 unrouted)
N$21  (1 unrouted)
N$25  (1 unrouted)
N$61  (via drill 0.6)
  Top 0.406: v20.83,5.46 20.83,14.48 v28.45,22.1
  Bottom 0.406: D-.2 20.8,5.49 v20.83,5.46 | v28.45,22.1 30.35,22.1 30.48,22.23 31.95,22.23 IC1.3
N$62  (via drill 0.6)
  Top 0.406: v15.62,9.65 15.62,10.67 25.53,20.57 v25.53,21.46
  Bottom 0.406: D+.2 18.72,8.96 18.03,9.65 v15.62,9.65 | v25.53,21.46 26.67,21.46 26.8,21.34 27.3,21.34 28.07,20.57 29.21,20.57 30.1,21.46 31.98,21.46 IC1.4
N$63
  Bottom 0.406: C2.1 15.11,15.46 15.11,13.34 17.94,10.51 CLK.P$1 24.48,10.51 26.04,12.06 26.67,12.06 26.92,12.32 26.92,14 IC1.16
N$64  (1 unrouted)
  Bottom 0.406: CLK.P$2 25.4,6.51 C1.1
N$67
  Bottom 0.406: D+.1 13.18,7.84 12.45,7.11 12.39,7.17 CN1.D+
N$68
  Bottom 0.406: CN1.D- 12.68,6.37 12.7,6.35 15.85,6.35 D-.1
OTHER_DIRECTION_LED0  (1 unrouted)
OTHER_DIRECTION_LED1  (1 unrouted)
OTHER_DIRECTION_LED2  (1 unrouted)
OTHER_DIRECTION_LED3  (1 unrouted)
OTHER_DIRECTION_LED4  (1 unrouted)
OTHER_DIRECTION_LED5  (1 unrouted)
OTHER_DIRECTION_LED6  (1 unrouted)
OTHER_DIRECTION_LED7  (1 unrouted)
REAR_MAIN_LEFT1  (1 unrouted)
RST  (1 unrouted)
  Bottom 0.406: IC1.13 29.42,9.97 RST_RES.1
SCK  (1 unrouted)
SIGNAL_STRENGTH_LED0  (1 unrouted)
SIGNAL_STRENGTH_LED1  (1 unrouted)
SIGNAL_STRENGTH_LED2  (1 unrouted)
SIGNAL_STRENGTH_LED3  (1 unrouted)
SIGNAL_STRENGTH_LED4  (1 unrouted)
SIGNAL_STRENGTH_LED5  (1 unrouted)
SIGNAL_STRENGTH_LED6  (1 unrouted)
SIGNAL_STRENGTH_LED7  (1 unrouted)
SIGNAL_STRENGTH_LED8  (1 unrouted)
SIGNAL_STRENGTH_LED9  (1 unrouted)
SIGNAL_STRENGTH_LED10  (1 unrouted)
SIGNAL_STRENGTH_LED11  (1 unrouted)
SIGNAL_STRENGTH_LED12  (1 unrouted)
SIGNAL_STRENGTH_LED13  (1 unrouted)
SIGNAL_STRENGTH_LED14  (1 unrouted)
SIGNAL_STRENGTH_TRIANGLE_LED  (1 unrouted)
TWI_SCL  (6 unrouted)
TWI_SDA  (6 unrouted)
TYPE_LED0  (via drill 0.6)  (2 unrouted)
  Top 0.254: v27.56,4.95 38.51,4.95 TYPE5.K
  Bottom 0.254: TYPE5.K 40.72,2.75 42.16,4.19 48.87,4.19 TYPE4.A | TYPE6.A 24.27,3.57 25.65,4.95 v27.56,4.95
TYPE_LED1  (3 unrouted)
  Bottom 0.254: HWB2.1 46.47,2.68 48.13,1.02 51.11,1.02 TYPE4.K
TYPE_LED2  (2 unrouted)
  Top 0.254: TYPE6.K TYPE5.A
  Bottom 0.254: TYPE5.A 32.79,2.75 HWB1.1
VBUS
  Bottom 0.406: USB_FUSE.1 13.91,3.1 11.56,5.46 8.97,5.46 CN1.VBUS
VCC  (60 unrouted)
  Bottom 0.406: HWB.2 21.88,26.03 IC1.34

### Text on the board
tNames: AIRBORNE | LONG / RANGE | MEDIUM / RANGE | SHORT / RANGE | EARLY / WARNING | AWACS